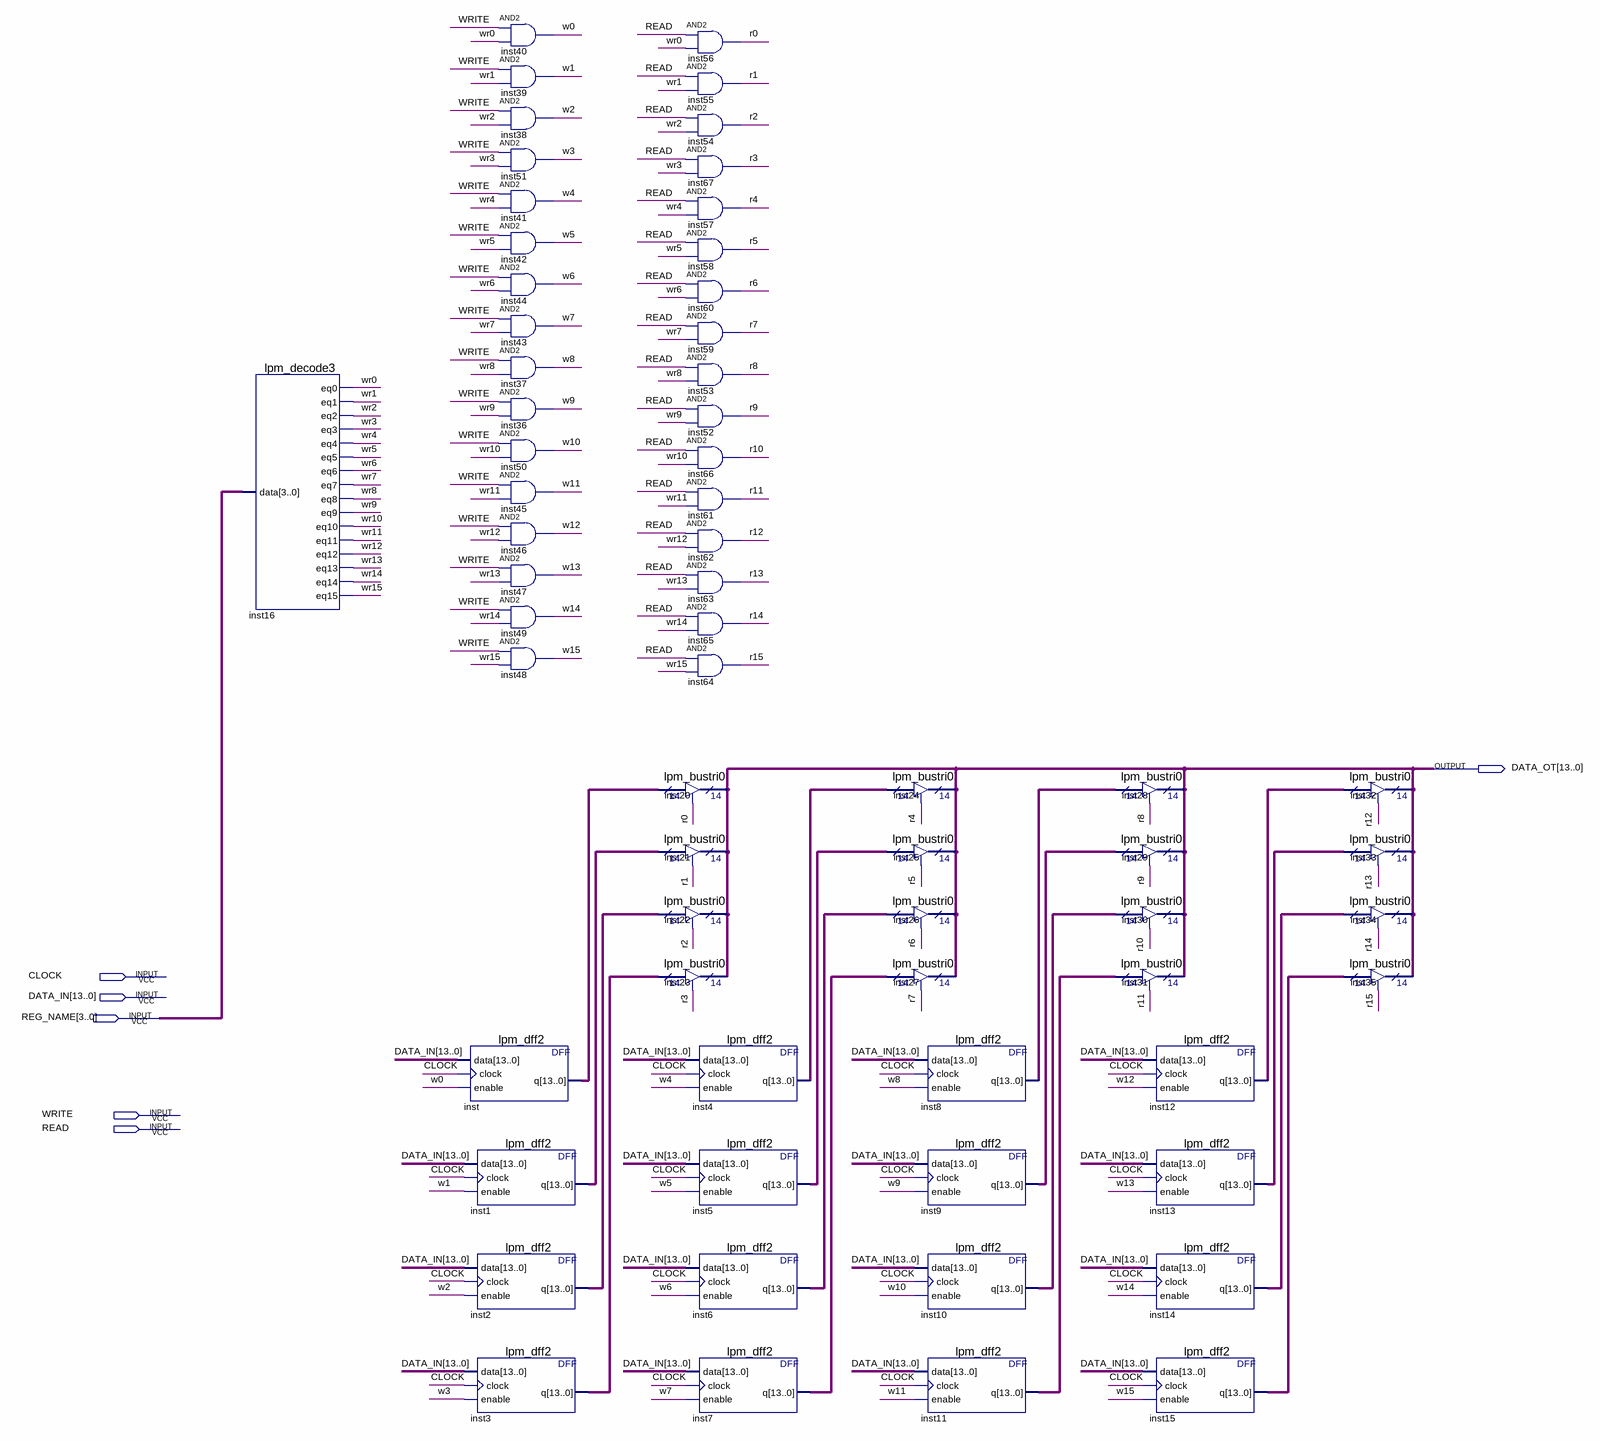
[diagram p0: schematic sheet]
// Quartus schematic GPR.bdf as structural Verilog: 65 symbols, 6 pins
module GPR (
  input  CLOCK,
  input  [13:0] DATA_IN,
  input  [3:0] REG_NAME,
  input  WRITE,
  input  READ,
  output [13:0] DATA_OT
);

  wire r0, r1, r2, r3, r4, r5, r6, r7, r8, r9, r10, r11, r12, r13, r14, r15, w0, w1, w2, w3, w4, w5, w6, w7,
       w8, w9, w10, w11, w12, w13, w14, w15, wr0, wr1, wr2, wr3, wr4, wr5, wr6, wr7, wr8, wr9, wr10, wr11,
       wr12, wr13, wr14, wr15;
  wire [13:0] inst1_q, inst2_q, inst3_q, inst4_q, inst5_q, inst6_q, inst7_q, inst8_q, inst9_q, inst10_q,
       inst11_q, inst12_q, inst13_q, inst14_q, inst15_q, inst_q;

  lpm_decode3 inst16 (
    .data(REG_NAME), .eq0(wr0), .eq1(wr1), .eq2(wr2), .eq3(wr3), .eq4(wr4), .eq5(wr5), .eq6(wr6), .eq7(wr7),
    .eq8(wr8), .eq9(wr9), .eq10(wr10), .eq11(wr11), .eq12(wr12), .eq13(wr13), .eq14(wr14), .eq15(wr15));
  lpm_dff2 inst (.data(DATA_IN), .clock(CLOCK), .enable(w0), .q(inst_q));
  lpm_dff2 inst1 (.data(DATA_IN), .clock(CLOCK), .enable(w1), .q(inst1_q));
  lpm_dff2 inst2 (.data(DATA_IN), .clock(CLOCK), .enable(w2), .q(inst2_q));
  lpm_dff2 inst3 (.data(DATA_IN), .clock(CLOCK), .enable(w3), .q(inst3_q));
  and inst40 (w0, WRITE, wr0);
  and inst39 (w1, WRITE, wr1);
  and inst38 (w2, WRITE, wr2);
  and inst51 (w3, WRITE, wr3);
  and inst41 (w4, WRITE, wr4);
  and inst42 (w5, WRITE, wr5);
  and inst44 (w6, WRITE, wr6);
  and inst43 (w7, WRITE, wr7);
  and inst37 (w8, WRITE, wr8);
  and inst36 (w9, WRITE, wr9);
  and inst50 (w10, WRITE, wr10);
  and inst45 (w11, WRITE, wr11);
  and inst46 (w12, WRITE, wr12);
  and inst47 (w13, WRITE, wr13);
  and inst49 (w14, WRITE, wr14);
  and inst48 (w15, WRITE, wr15);
  and inst56 (r0, READ, wr0);
  and inst55 (r1, READ, wr1);
  and inst54 (r2, READ, wr2);
  and inst67 (r3, READ, wr3);
  and inst57 (r4, READ, wr4);
  and inst58 (r5, READ, wr5);
  and inst60 (r6, READ, wr6);
  and inst59 (r7, READ, wr7);
  and inst53 (r8, READ, wr8);
  and inst52 (r9, READ, wr9);
  and inst66 (r10, READ, wr10);
  and inst61 (r11, READ, wr11);
  and inst62 (r12, READ, wr12);
  and inst63 (r13, READ, wr13);
  and inst65 (r14, READ, wr14);
  and inst64 (r15, READ, wr15);
  lpm_bustri0 inst20 (.enabledt(r0), .data(inst_q), .tridata(DATA_OT));
  lpm_bustri0 inst21 (.enabledt(r1), .data(inst1_q), .tridata(DATA_OT));
  lpm_bustri0 inst22 (.enabledt(r2), .data(inst2_q), .tridata(DATA_OT));
  lpm_bustri0 inst23 (.enabledt(r3), .data(inst3_q), .tridata(DATA_OT));
  lpm_dff2 inst4 (.data(DATA_IN), .clock(CLOCK), .enable(w4), .q(inst4_q));
  lpm_dff2 inst5 (.data(DATA_IN), .clock(CLOCK), .enable(w5), .q(inst5_q));
  lpm_dff2 inst6 (.data(DATA_IN), .clock(CLOCK), .enable(w6), .q(inst6_q));
  lpm_dff2 inst7 (.data(DATA_IN), .clock(CLOCK), .enable(w7), .q(inst7_q));
  lpm_bustri0 inst24 (.enabledt(r4), .data(inst4_q), .tridata(DATA_OT));
  lpm_bustri0 inst25 (.enabledt(r5), .data(inst5_q), .tridata(DATA_OT));
  lpm_bustri0 inst26 (.enabledt(r6), .data(inst6_q), .tridata(DATA_OT));
  lpm_bustri0 inst27 (.enabledt(r7), .data(inst7_q), .tridata(DATA_OT));
  lpm_dff2 inst8 (.data(DATA_IN), .clock(CLOCK), .enable(w8), .q(inst8_q));
  lpm_dff2 inst9 (.data(DATA_IN), .clock(CLOCK), .enable(w9), .q(inst9_q));
  lpm_dff2 inst10 (.data(DATA_IN), .clock(CLOCK), .enable(w10), .q(inst10_q));
  lpm_dff2 inst11 (.data(DATA_IN), .clock(CLOCK), .enable(w11), .q(inst11_q));
  lpm_bustri0 inst28 (.enabledt(r8), .data(inst8_q), .tridata(DATA_OT));
  lpm_bustri0 inst29 (.enabledt(r9), .data(inst9_q), .tridata(DATA_OT));
  lpm_bustri0 inst30 (.enabledt(r10), .data(inst10_q), .tridata(DATA_OT));
  lpm_bustri0 inst31 (.enabledt(r11), .data(inst11_q), .tridata(DATA_OT));
  lpm_dff2 inst12 (.data(DATA_IN), .clock(CLOCK), .enable(w12), .q(inst12_q));
  lpm_dff2 inst13 (.data(DATA_IN), .clock(CLOCK), .enable(w13), .q(inst13_q));
  lpm_dff2 inst14 (.data(DATA_IN), .clock(CLOCK), .enable(w14), .q(inst14_q));
  lpm_dff2 inst15 (.data(DATA_IN), .clock(CLOCK), .enable(w15), .q(inst15_q));
  lpm_bustri0 inst32 (.enabledt(r12), .data(inst12_q), .tridata(DATA_OT));
  lpm_bustri0 inst33 (.enabledt(r13), .data(inst13_q), .tridata(DATA_OT));
  lpm_bustri0 inst34 (.enabledt(r14), .data(inst14_q), .tridata(DATA_OT));
  lpm_bustri0 inst35 (.enabledt(r15), .data(inst15_q), .tridata(DATA_OT));
endmodule
